# Altium schematic sheet ECG.SchDoc
size 420 x 297 mm; SheetNumber: 5; SheetTotal: 6
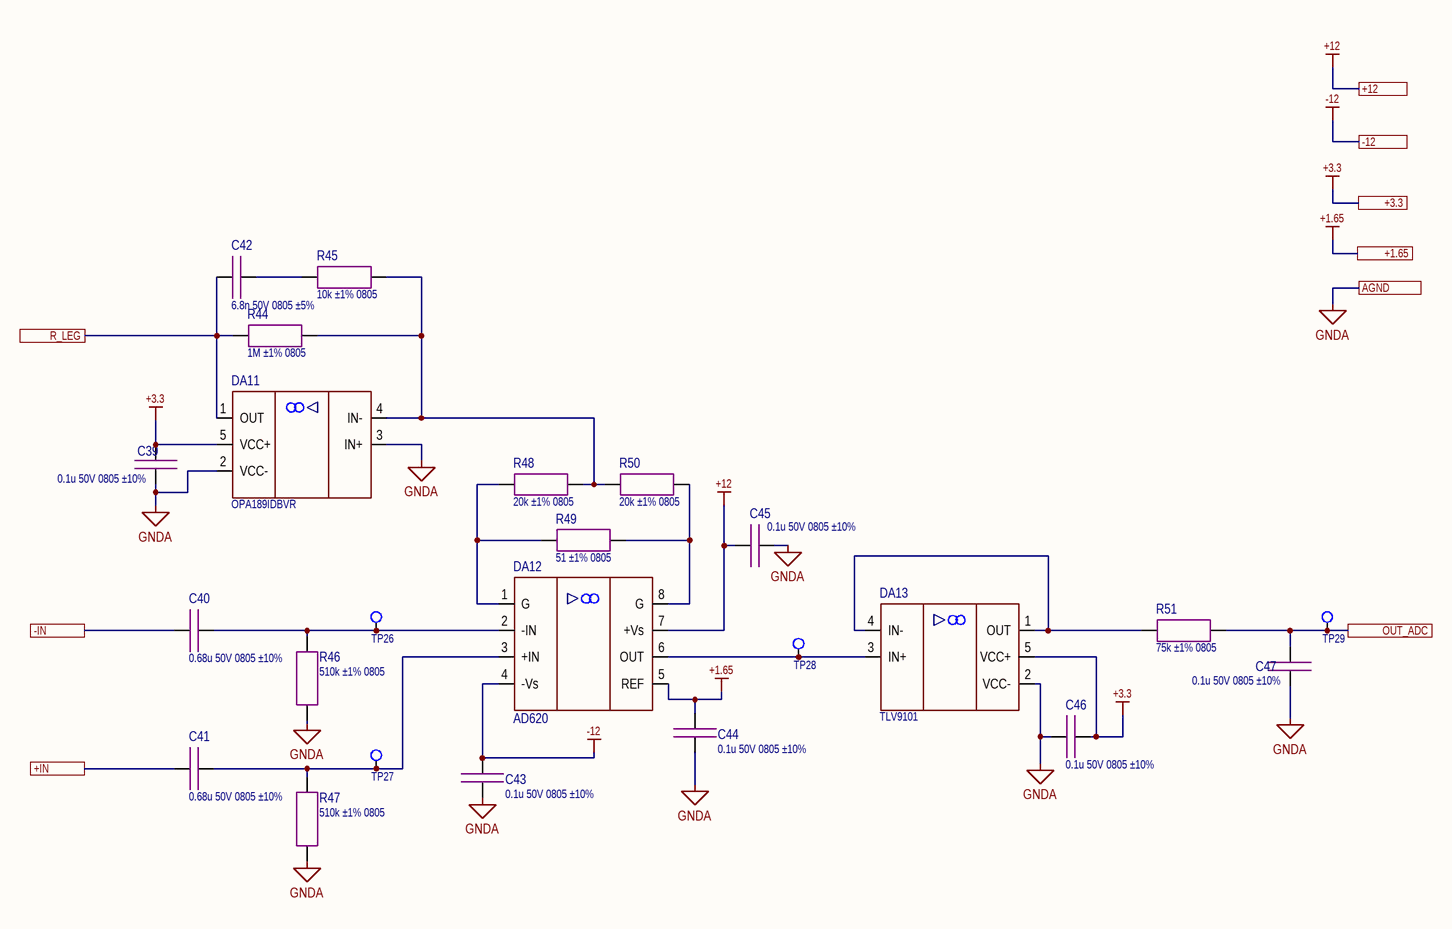
[diagram p0: ECG.SchDoc]

## Parts
C39  0.1u 50V 0805 ±10%  [CAP: SMD 0805 MD IPC 782]
C40  0.68u 50V 0805 ±10%  [CAP: SMD 0805 MD IPC 782]
C41  0.68u 50V 0805 ±10%  [CAP: SMD 0805 MD IPC 782]
C42  6.8n 50V 0805 ±5%  [CAP: SMD 0805 MD IPC 782]
C43  0.1u 50V 0805 ±10%  [CAP: SMD 0805 MD IPC 782]
C44  0.1u 50V 0805 ±10%  [CAP: SMD 0805 MD IPC 782]
C45  0.1u 50V 0805 ±10%  [CAP: SMD 0805 MD IPC 782]
C46  0.1u 50V 0805 ±10%  [CAP: SMD 0805 MD IPC 782]
C47  0.1u 50V 0805 ±10%  [CAP: SMD 0805 MD IPC 782]
DA11  OPA189IDBVR  [IC: SOT 23 5pin]
DA12  AD620  [IC: SOIC 8]
DA13  TLV9101  [IC: SOT 23 5pin]
R44  1M ±1% 0805  [RES: SMD 0805 MD IPC 782]
R45  10k ±1% 0805  [RES: SMD 0805 MD IPC 782]
R46  510k ±1% 0805  [RES: SMD 0805 MD IPC 782]
R47  510k ±1% 0805  [RES: SMD 0805 MD IPC 782]
R48  20k ±1% 0805  [RES: SMD 0805 MD IPC 782]
R49  51 ±1% 0805  [RES: SMD 0805 MD IPC 782]
R50  20k ±1% 0805  [RES: SMD 0805 MD IPC 782]
R51  75k ±1% 0805  [RES: SMD 0805 MD IPC 782]
TP26  Test point  [Test Point]  (value not drawn)  (net tie)
TP27  Test point  [Test Point]  (value not drawn)  (net tie)
TP28  Test point  [Test Point]  (value not drawn)  (net tie)
TP29  Test point  [Test Point]  (value not drawn)  (net tie)

## Ports
+1.65 (see REO_ECG[3B], Generator_REO[1A], POWER[1A]), +3.3 (see REO_ECG[2A], INTERFACES[4A], POWER[1A]), +12 (see REO_ECG[2A], Generator_REO[1A], INTERFACES[4A], Measurement_REO[4A], POWER[1B]), +IN (see REO_ECG[3A]), -12 (see REO_ECG[2A], Generator_REO[1B], INTERFACES[4A], Measurement_REO[4A], POWER[1B]), -IN (see REO_ECG[3A]), AGND (see REO_ECG[2B], Generator_REO[1B], Measurement_REO[4A], POWER[1B]), OUT_ADC (see REO_ECG[2B]), R_LEG (see REO_ECG[3A])

## Nets
+1.65: C44.2 DA12.5(REF) ; port +1.65
+3.3: C39.1 C46.1 DA11.5(VCC+) DA13.5(VCC+) ; port +3.3
+12: C45.1 DA12.7(+Vs) ; port +12
-12: C43.1 DA12.4(-Vs) ; port -12
GNDA: C39.2 C43.2 C44.1 C45.2 C46.2 C47.2 DA11.2(VCC-) DA11.3(IN+) DA13.2(VCC-) R46.1 R47.1 ; port AGND
+IN: C41.2 ; port +IN
-IN: C40.2 ; port -IN
OUT_ADC: C47.1 R51.2 TP29.1 ; port OUT_ADC
R_LEG: C42.2 DA11.1(OUT) R44.1 ; port R_LEG
NetC40_1: C40.1 DA12.2(-IN) R46.2 TP26.1
NetC41_1: C41.1 DA12.3(+IN) R47.2 TP27.1
NetC42_1: C42.1 R45.1
NetDA11_4: DA11.4(IN-) R44.2 R45.2 R48.2 R50.1
NetDA12_1: DA12.1(G) R48.1 R49.1
NetDA12_6: DA12.6(OUT) DA13.3(IN+) TP28.1
NetDA12_8: DA12.8(G) R49.2 R50.2
NetDA13_1: DA13.1(OUT) DA13.4(IN-) R51.1

## Notes on the sheet
- Подп. и дата
- Инв. № дубл.
- Взам. инв. №
- Инв. № подл.
- Изм.
- Лист
- № докум.
- Подп.
- Дата
- 2.106-A3
- Копировал
- Формат А3

## Library data of the parts
C39 C43-C47 = 0.1u 50V 0805 ±10%: Code: 6279254871; Name: Конденсатор X7R 50V 0,1uF ±10% 0805
C40 C41 = 0.68u 50V 0805 ±10%: Name: Конденсатор 0805B224K500NT, Fenghua
C42 = 6.8n 50V 0805 ±5%: Code: 6279352311; Name: Конденсатор NPO 50V 6800pF ±5% 0805
DA11 = OPA189IDBVR: Name: Микросхема OPA189IDBVR
DA13 = TLV9101: Code: 6339115821; Name: Микросхема TLV9101IDBVR
R44 = 1M ±1% 0805: Name: Резистор RC0805FR-071KL, Yageo
R45 = 10k ±1% 0805: Code: 6020003061; Name: Резистор RC0805JR-0710KL
R46 R47 = 510k ±1% 0805: Code: 6094357031; Name: Резистор 510K±1% 0805
R48 R50 = 20k ±1% 0805: Code: 6094357581; Name: Резистор 20K±1% 0805
R49 = 51 ±1% 0805: Code: 6094354057; Name: Резистор 51K±1% 0805
R51 = 75k ±1% 0805: Name: Резистор 75К±1% 0805